# Altium schematic sheet Condor2a_Power_Module.SchDoc
size A4
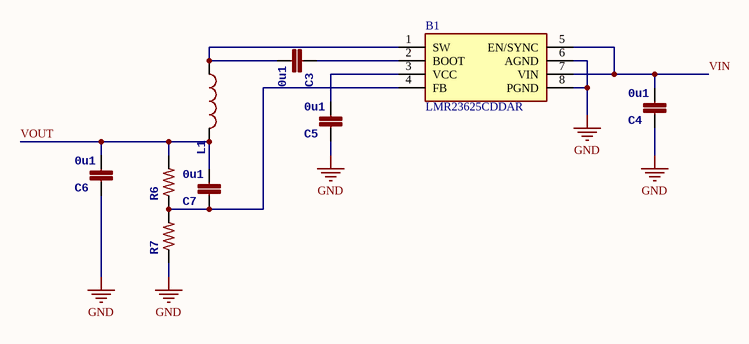
[diagram p0: Condor2a_Power_Module.SchDoc]

## Parts
B1  LMR23625CDDAR  [SOT127P600X170-8N]
C3  0u1  [0402-CAP]
C4  0u1  [0402-CAP]
C5  0u1  [0402-CAP]
C6  0u1  [0402-CAP]
C7  0u1  [0402-CAP]
L1  INDUCTOR0805  [0805-IND]  (value not drawn)
R6  RESISTOR0402-RES  [0402-RES]  (value not drawn)
R7  RESISTOR0402-RES  [0402-RES]  (value not drawn)

## Nets
GND: B1.6(AGND) B1.8(PGND) C4.P$2 C5.P$2 C6.P$2 R7.P1
VIN: B1.5(EN/SYNC) B1.7(VIN) C4.P$1
VOUT: C6.P$1 C7.P$1 L1.P$2 R6.P2
NetB1_1: B1.1(SW) C3.P$1 L1.P$1
NetB1_2: B1.2(BOOT) C3.P$2
NetB1_3: B1.3(VCC) C5.P$1
NetB1_4: B1.4(FB) C7.P$2 R6.P1 R7.P2

## Library data of the parts
B1 = LMR23625CDDAR: SIMPLE SWITCHER, 36V 2.5A Synchronous Step-Down Converter; Manufacturer_Name: Texas Instruments; Geometry.Height: 1.7mm; Mouser Part Number: 595-LMR23625CDDAR; Mouser Price/Stock: https://www.mouser.co.uk/ProductDetail/Texas-Instruments/LMR23625CDDAR?qs=8%2FmU9qzJpL%2FuNiFnLdW2uw%3D%3D; Manufacturer_Part_Number: LMR23625CDDAR; Datasheet Link: http://www.ti.com/lit/gpn/lmr23625
C3-C7 = CAP0402: PARTNO: CC0402ZRY5V7BB104; Supplier 1: Digi-Key
  C3-C5 C7: Supplier Part Number 1: 311-1047-1-ND
L1 = INDUCTOR0805: Supplier 1: Digi-Key; Supplier Part Number 1: 240-2389-6-ND